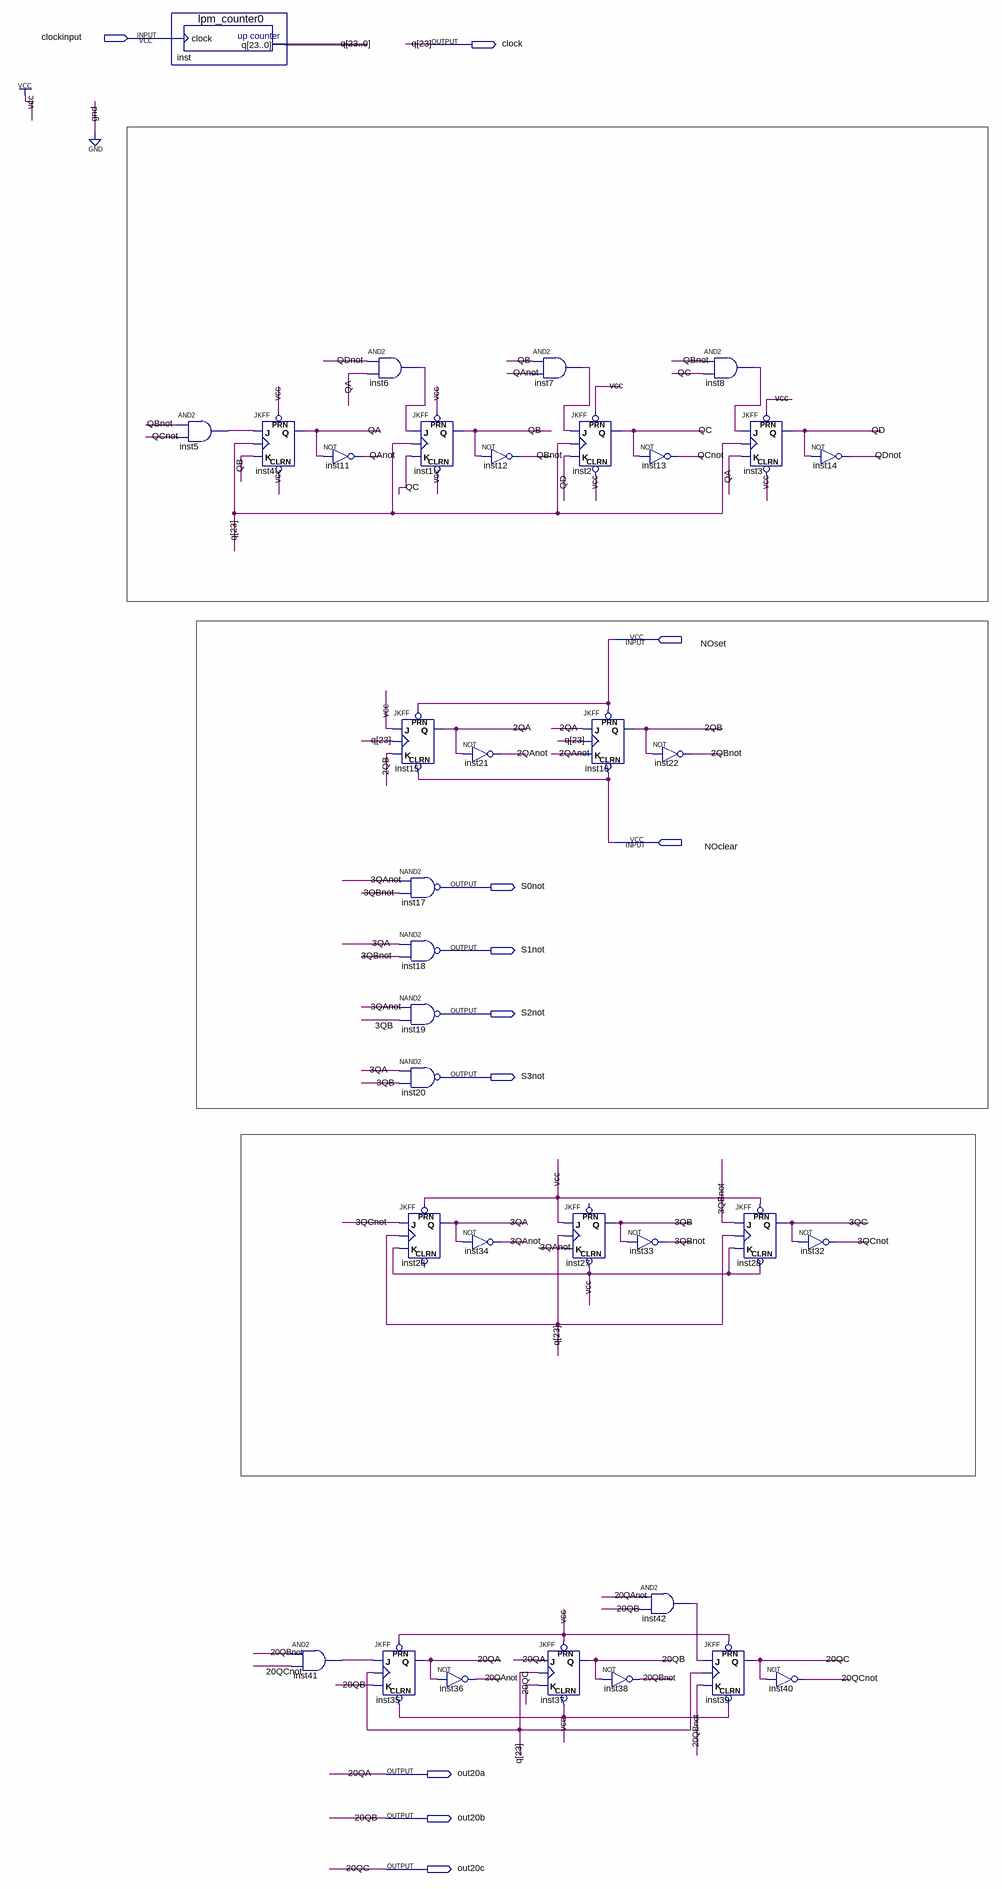
[diagram p0: schematic sheet]
// Quartus schematic Test5part2.bdf as structural Verilog: 35 symbols, 11 pins
module Test5part2 (
  input  clockinput,
  input  NOset,
  input  NOclear,
  output clock,
  output S0not,
  output S1not,
  output S2not,
  output S3not,
  output out20a,
  output out20b,
  output out20c
);

  wire \2QA , \2QAnot , \2QB , \2QBnot , \3QA , \3QAnot , \3QB , \3QBnot , \3QC , \3QCnot , \20QAnot ,
       \20QBnot , \20QCnot , inst5_out, inst6_out, inst7_out, inst8_out, inst41_out, inst42_out, QA, QAnot,
       QB, QBnot, QC, QCnot, QD, QDnot;
  wire [22:0] q;

  lpm_counter0 inst (.clock(clockinput), .q({clock, q}));
  and inst5 (inst5_out, QBnot, QCnot);
  JKFF inst4 (.PRN(1'b1), .CLRN(1'b1), .K(QB), .J(inst5_out), .CLK(clock), .Q(QA));
  not inst11 (QAnot, QA);
  and inst41 (inst41_out, \20QBnot , \20QCnot );
  and inst6 (inst6_out, QDnot, QA);
  JKFF inst35 (.PRN(1'b1), .CLRN(1'b1), .K(out20b), .J(inst41_out), .CLK(clock), .Q(out20a));
  JKFF inst1 (.PRN(1'b1), .CLRN(1'b1), .K(QC), .J(inst6_out), .CLK(clock), .Q(QB));
  JKFF inst15 (.PRN(NOset), .CLRN(NOclear), .K(\2QB ), .J(1'b1), .CLK(clock), .Q(\2QA ));
  nand inst17 (S0not, \3QAnot , \3QBnot );
  nand inst18 (S1not, \3QA , \3QBnot );
  nand inst19 (S2not, \3QAnot , \3QB );
  nand inst20 (S3not, \3QA , \3QB );
  JKFF inst26 (.PRN(1'b1), .K(1'b1), .J(\3QCnot ), .CLK(clock), .Q(\3QA ));  // open: CLRN
  not inst36 (\20QAnot , out20a);
  not inst12 (QBnot, QB);
  not inst21 (\2QAnot , \2QA );
  not inst34 (\3QAnot , \3QA );
  and inst7 (inst7_out, QB, QAnot);
  JKFF inst37 (.PRN(1'b1), .CLRN(1'b1), .K(out20c), .J(out20a), .CLK(clock), .Q(out20b));
  JKFF inst2 (.PRN(1'b1), .CLRN(1'b1), .K(QD), .J(inst7_out), .CLK(clock), .Q(QC));
  JKFF inst16 (.PRN(NOset), .CLRN(NOclear), .K(\2QAnot ), .J(\2QA ), .CLK(clock), .Q(\2QB ));
  JKFF inst27 (.CLRN(1'b1), .K(\3QAnot ), .J(1'b1), .CLK(clock), .Q(\3QB ));  // open: PRN
  not inst13 (QCnot, QC);
  not inst33 (\3QBnot , \3QB );
  and inst42 (inst42_out, \20QAnot , out20b);
  not inst38 (\20QBnot , out20b);
  not inst22 (\2QBnot , \2QB );
  and inst8 (inst8_out, QBnot, QC);
  JKFF inst3 (.PRN(1'b1), .CLRN(1'b1), .K(QA), .J(inst8_out), .CLK(clock), .Q(QD));
  JKFF inst28 (.PRN(1'b1), .CLRN(1'b1), .K(1'b1), .J(\3QBnot ), .CLK(clock), .Q(\3QC ));
  JKFF inst39 (.PRN(1'b1), .CLRN(1'b1), .K(\20QBnot ), .J(inst42_out), .CLK(clock), .Q(out20c));
  not inst40 (\20QCnot , out20c);
  not inst14 (QDnot, QD);
  not inst32 (\3QCnot , \3QC );

  // Other names for the same wires on the sheet: 20QA = out20a; 20QB = out20b; 20QC = out20c; q[23] = clock
endmodule
